# EAGLE schematic BasicCircuit (EAGLE 6.5.0)
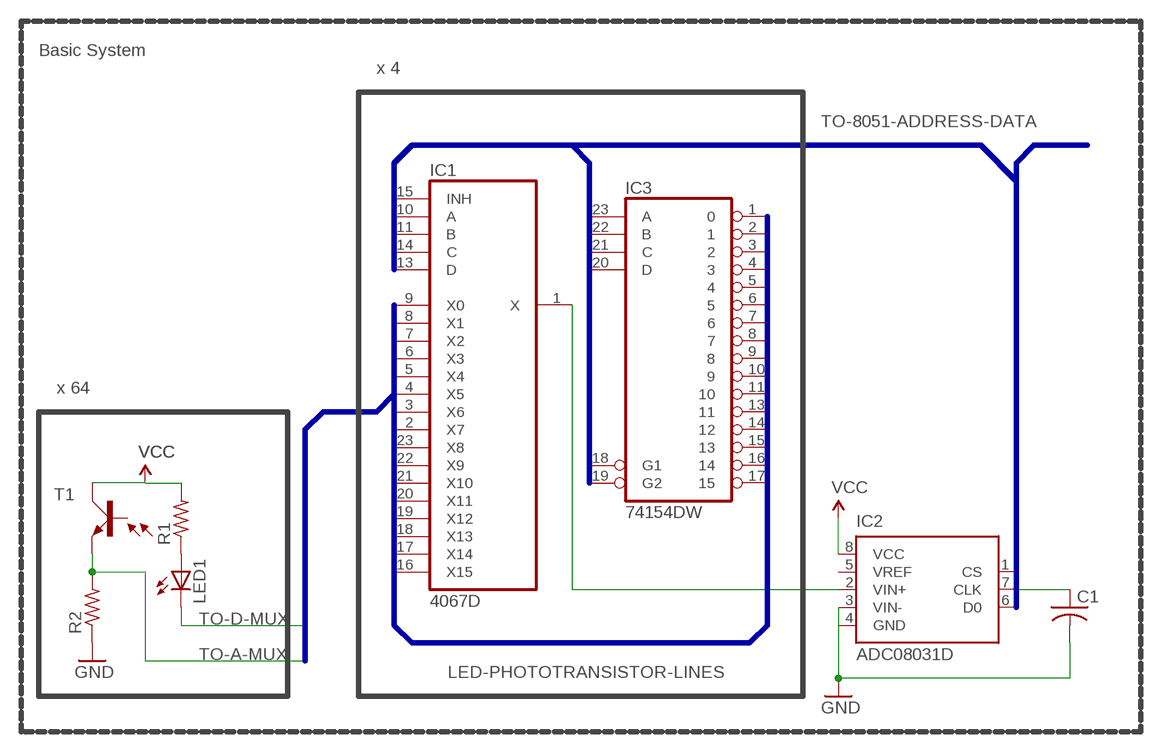
[diagram p0: schematic, sheet 1]

## Parts
C1  C-US025_050-035X075  [C025_050-035X075]
IC1  4067D  [SO24W]
IC2  ADC08031D  [SO08]
IC3  74154DW  [SO24W]
LED1  LED  [SMARTLED-TTW]
R1  R-US_0204/2V  [0204V]
R2  R-US_0204/2V  [0204V]
T1  SFH303  [SFH303]

## Nets
GND: C1.2 IC2.3(VIN-) R2.1
N$1: LED1.A@1(A) R1.1
N$2: IC1.1(X) IC2.2(VIN+)
N$4: C1.1 IC2.7(CLK)
TO-A-MUX: R2.2 T1.1(E)
TO-D-MUX: LED1.C@1(C)
VCC: IC2.8(VCC) R1.2 T1.2(C)
Unconnected: IC1.2(X7) IC1.3(X6) IC1.4(X5) IC1.5(X4) IC1.6(X3) IC1.7(X2) IC1.8(X1) IC1.9(X0) IC1.10(A) IC1.11(B) IC1.13(D) IC1.14(C) IC1.15(INH) IC1.16(X15) IC1.17(X14) IC1.18(X13) IC1.19(X12) IC1.20(X11) IC1.21(X10) IC1.22(X9) IC1.23(X8) IC2.1(CS) IC2.5(VREF) IC2.6(D0) IC3.1 IC3.2 IC3.3 IC3.4 IC3.5 IC3.6 IC3.7 IC3.8 IC3.9 IC3.10 IC3.11 IC3.13 IC3.14 IC3.15 IC3.16 IC3.17 IC3.18(G1) IC3.19(G2) IC3.20(D) IC3.21(C) IC3.22(B) IC3.23(A) T1.3(B)

## Buses
LED-PHOTOTRANSISTOR-LINES
TO-8051-ADDRESS-DATA

## Notes on the sheet
- Basic System
- x 4
- x 64

## Power pins joined to a net without a drawn wire
GND: IC2.4(GND) IC3.12(GND)
VCC: IC3.24(VCC)
VDD: IC1.24(VDD)
VSS: IC1.12(VSS)

## Library data of the parts
C1 = resistor:C-US: CAPACITOR, American symbol
IC1 = 40xx:4067: 16-channel ANALOG MULTIPLEXER
IC2 = linear:ADC08031: A/D CONVERTER
IC3 = 74xx-us:74*154: 4-line to 16-line data SELECTOR/MULTIPLEXER
LED1 = led:LED: LED OSRAM: - CHIPLED LG R971, LG N971, LY N971, LG Q971, LY Q971, LO R971, LY R971 LH N974, LH R974 LS Q976, LO Q976, LY Q976 LO Q996 - Hyper CHIPLED LW Q18S LB Q993, LB Q99A, LB R99A - SideLED LS A670, LO A670, LY A670, LG A670, LP A670 LB A673, LV A673, LT A673, LW A673 LH A674 LY A675 LS A676, LA A676, LO A676, LY A676, LW A676 LS A679, LY A679, LG A679 - Hyper Micro SIDELED® LS Y876, LA Y876, LO Y876, LY Y876 LT Y87S - SmartLED LW L88C, LW L88S LB L89C, LB L89S, LG L890 LS L89K, LO L89K, LY L89K LS L896, LA L896, LO L896, LY L896 - TOPLED LS T670, LO T670, LY T670, LG T670, LP T670 LSG T670, LSP T670, LSY T670, LOP T670, LYG T670 LG T671, LOG T671, LSG T671 LB T673, LV T673, LT T673, LW T673 LH T674 LS T676, LA T676, LO T676, LY T676, LB T676, LH T676, LSB T676, LW T676 LB T67C, LV T67C, LT T67C, LS T67K, LO T67K, LY T67K, LW E67C LS E67B, LA E67B, LO E67B, LY E67B, LB E67C, LV E67C, LT E67C LW T67C LS T679, LY T679, LG T679 LS T770, LO T770, LY T770, LG T770, LP T770 LB T773, LV T773, LT T773, LW T773 LH T774 LS E675, LA E675, LY E675, LS T675 LS T776, LA T776, LO T776, LY T776, LB T776 LHGB T686 LT T68C, LB T68C - Hyper Mini TOPLED® LB M676 - Mini TOPLED Santana® LG M470 LS M47K, LO M47K, LY M47K Source: http://www.osram.convergy.de LUXEON: - LUMILED® LXK2-PW12-R00, LXK2-PW12-S00, LXK2-PW14-U00, LXK2-PW14-V00 LXK2-PM12-R00, LXK2-PM12-S00, LXK2-PM14-U00 LXK2-PE12-Q00, LXK2-PE12-R00, LXK2-PE12-S00, LXK2-PE14-T00, LXK2-PE14-U00 LXK2-PB12-K00, LXK2-PB12-L00, LXK2-PB12-M00, LXK2-PB14-N00, LXK2-PB14-P00, LXK2-PB14-Q00 LXK2-PR12-L00, LXK2-PR12-M00, LXK2-PR14-Q00, LXK2-PR14-R00 LXK2-PD12-Q00, LXK2-PD12-R00, LXK2-PD12-S00 LXK2-PH12-R00, LXK2-PH12-S00 LXK2-PL12-P00, LXK2-PL12-Q00, LXK2-PL12-R00 Source: www.luxeon.com KINGBRIGHT: KA-3528ASYC Source: www.kingbright.com
R1 R2 = resistor:R-US_: RESISTOR, American symbol
T1 = opto-trans-siemens:SFH303: Silicium NPN Phototransistor Source: Siemens; OC_FARNELL: unknown; OC_NEWARK: unknown